# EAGLE design schemat (EAGLE 9.5.2)
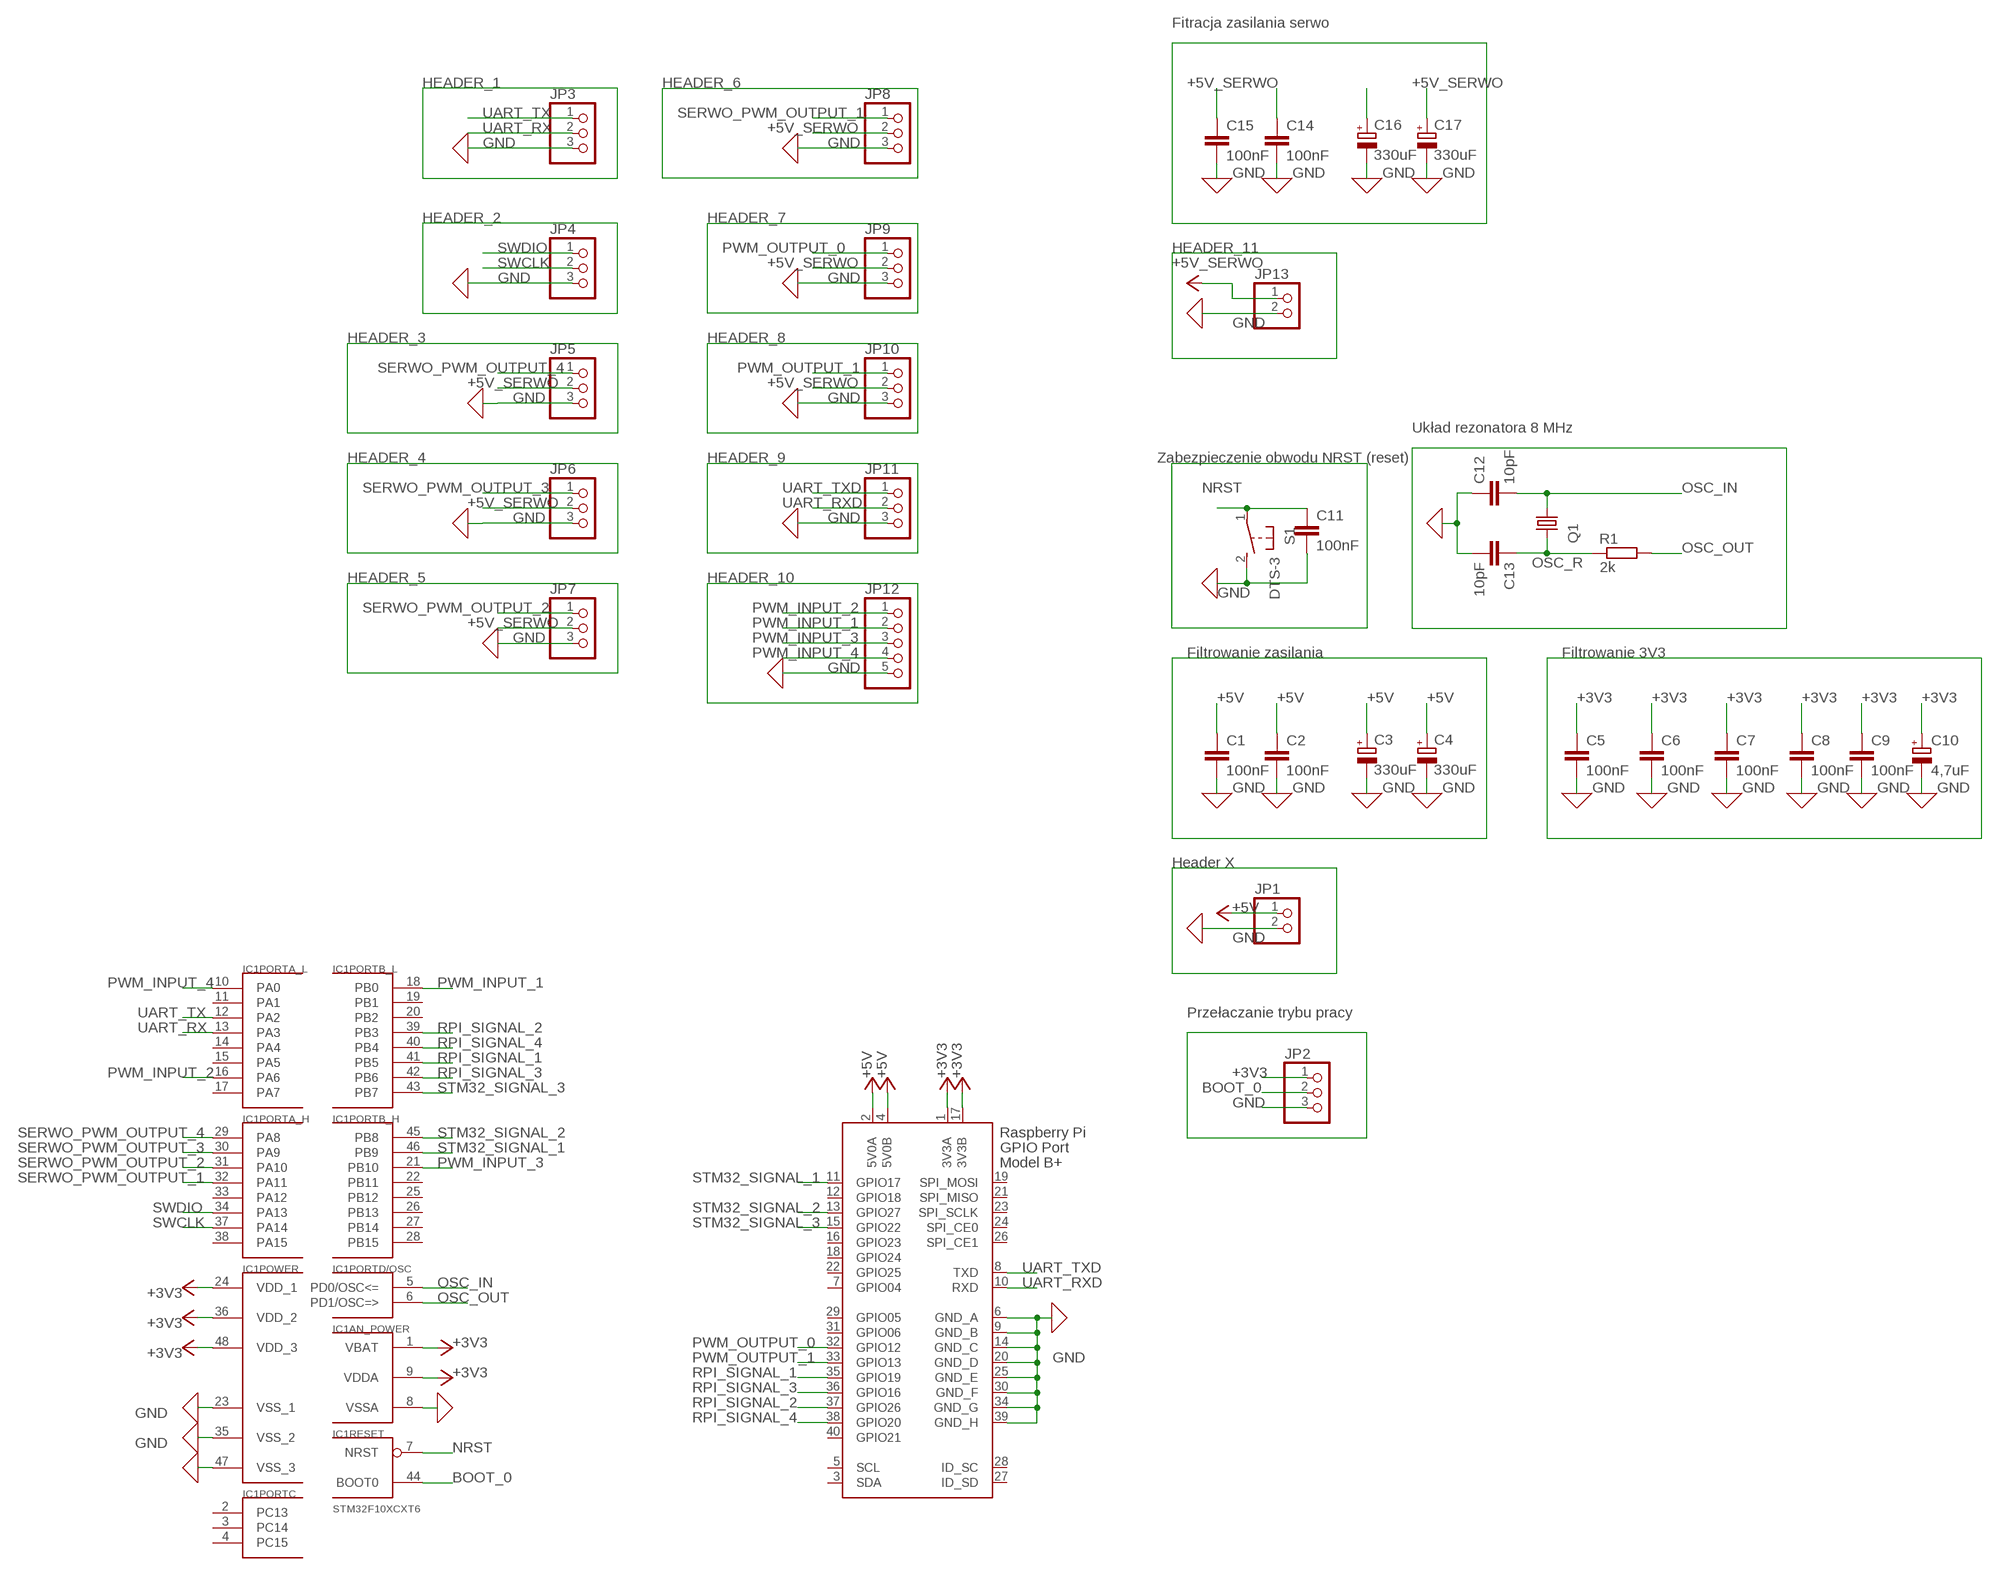
[diagram p0: schematic, sheet 1]

## Parts
C1  100nF  C-EUC0603  [C0603]
C2  100nF  C-EUC0603  [C0603]
C3  330uF  CPOL-EUE3.5-10  [E3,5-10]
C4  330uF  CPOL-EUE3.5-10  [E3,5-10]
C5  100nF  C-EUC0603  [C0603]
C6  100nF  C-EUC0603  [C0603]
C7  100nF  C-EUC0603  [C0603]
C8  100nF  C-EUC0603  [C0603]
C9  100nF  C-EUC0603  [C0603]
C10  4,7uF  CPOL-EUE2.5-4V  [E2,5RE]
C11  100nF  C-EUC0603  [C0603]
C12  10pF  C-EUC0603  [C0603]
C13  10pF  C-EUC0603  [C0603]
C14  100nF  C-EUC0603  [C0603]
C15  100nF  C-EUC0603  [C0603]
C16  330uF  CPOL-EUE3.5-10  [E3,5-10]
C17  330uF  CPOL-EUE3.5-10  [E3,5-10]
IC1  STM32F10XCXT6  [TQFP48]
JP1  PINHD-1X2  [1X02]
JP2  PINHD-1X3  [1X03]
JP3  PINHD-1X3  [1X03]
JP4  PINHD-1X3  [1X03]
JP5  PINHD-1X3  [1X03]
JP6  PINHD-1X3  [1X03]
JP7  PINHD-1X3  [1X03]
JP8  PINHD-1X3  [1X03]
JP9  PINHD-1X3  [1X03]
JP10  PINHD-1X3  [1X03]
JP11  PINHD-1X3  [1X03]
JP12  PINHD-1X5  [1X05]
JP13  PINHD-1X2  [1X02]
Q1  CRYSTALHC49UP  [HC49UP]
R1  2k  R-EU_R0603  [R0603]
S1  DTS-3  [DTS-3]
X1  RASPI_BOARD_B+#_E4P  [RASPI_BOARD_B+_EDGES_4DRILL_PAD]

## Nets
+3V3: C5.1 C6.1 C7.1 C8.1 C9.1 C10.+ IC1.1(AN_POWER:VBAT) IC1.9(AN_POWER:VDDA) IC1.24(POWER:VDD_1) IC1.36(POWER:VDD_2) IC1.48(POWER:VDD_3) JP2.1 X1.1(3V3A) X1.17(3V3B)
+5V: C1.1 C2.1 C3.+ C4.+ JP1.1 X1.2(5V0A) X1.4(5V0B)
+5V_SERWO: C14.1 C15.1 C16.+ C17.+ JP5.2 JP6.2 JP7.2 JP8.2 JP9.2 JP10.2 JP13.1 ; supply symbol labelled +5V
BOOT_0: IC1.44(RESET:BOOT0) JP2.2
GND: C1.2 C2.2 C3.- C4.- C5.2 C6.2 C7.2 C8.2 C9.2 C10.- C11.2 C12.1 C13.2 C14.2 C15.2 C16.- C17.- IC1.8(AN_POWER:VSSA) IC1.23(POWER:VSS_1) IC1.35(POWER:VSS_2) IC1.47(POWER:VSS_3) JP1.2 JP2.3 JP3.3 JP4.3 JP5.3 JP6.3 JP7.3 JP8.3 JP9.3 JP10.3 JP11.3 JP12.5 JP13.2 S1.2 X1.6(GND_A) X1.9(GND_B) X1.14(GND_C) X1.20(GND_D) X1.25(GND_E) X1.30(GND_F) X1.34(GND_G) X1.39(GND_H)
NRST: C11.1 IC1.7(RESET:NRST) S1.1
OSC_IN: C12.2 IC1.5(PORTD/OSC:PD0/OSC<=) Q1.1
OSC_OUT: IC1.6(PORTD/OSC:PD1/OSC=>) R1.2
OSC_R: C13.1 Q1.2 R1.1
PWM_INPUT_1: IC1.18(PORTB_L:PB0) JP12.2
PWM_INPUT_2: IC1.16(PORTA_L:PA6) JP12.1
PWM_INPUT_3: IC1.21(PORTB_H:PB10) JP12.3
PWM_INPUT_4: IC1.10(PORTA_L:PA0) JP12.4
PWM_OUTPUT_0: JP9.1 X1.32(GPIO12)
PWM_OUTPUT_1: JP10.1 X1.33(GPIO13)
RPI_SIGNAL_1: IC1.41(PORTB_L:PB5) X1.35(GPIO19)
RPI_SIGNAL_2: IC1.39(PORTB_L:PB3) X1.37(GPIO26)
RPI_SIGNAL_3: IC1.42(PORTB_L:PB6) X1.36(GPIO16)
RPI_SIGNAL_4: IC1.40(PORTB_L:PB4) X1.38(GPIO20)
SERWO_PWM_OUTPUT_1: IC1.32(PORTA_H:PA11) JP8.1
SERWO_PWM_OUTPUT_2: IC1.31(PORTA_H:PA10) JP7.1
SERWO_PWM_OUTPUT_3: IC1.30(PORTA_H:PA9) JP6.1
SERWO_PWM_OUTPUT_4: IC1.29(PORTA_H:PA8) JP5.1
STM32_SIGNAL_1: IC1.46(PORTB_H:PB9) X1.11(GPIO17)
STM32_SIGNAL_2: IC1.45(PORTB_H:PB8) X1.13(GPIO27)
STM32_SIGNAL_3: IC1.43(PORTB_L:PB7) X1.15(GPIO22)
SWCLK: IC1.37(PORTA_H:PA14) JP4.2
SWDIO: IC1.34(PORTA_H:PA13) JP4.1
UART_RX: IC1.13(PORTA_L:PA3) JP3.2
UART_RXD: JP11.2 X1.10(RXD)
UART_TX: IC1.12(PORTA_L:PA2) JP3.1
UART_TXD: JP11.1 X1.8(TXD)
Unconnected: IC1.2(PORTC:PC13) IC1.3(PORTC:PC14) IC1.4(PORTC:PC15) IC1.11(PORTA_L:PA1) IC1.14(PORTA_L:PA4) IC1.15(PORTA_L:PA5) IC1.17(PORTA_L:PA7) IC1.19(PORTB_L:PB1) IC1.20(PORTB_L:PB2) IC1.22(PORTB_H:PB11) IC1.25(PORTB_H:PB12) IC1.26(PORTB_H:PB13) IC1.27(PORTB_H:PB14) IC1.28(PORTB_H:PB15) IC1.33(PORTA_H:PA12) IC1.38(PORTA_H:PA15) X1.3(SDA) X1.5(SCL) X1.7(GPIO04) X1.12(GPIO18) X1.16(GPIO23) X1.18(GPIO24) X1.19(SPI_MOSI) X1.21(SPI_MISO) X1.22(GPIO25) X1.23(SPI_SCLK) X1.24(SPI_CE0) X1.26(SPI_CE1) X1.27(ID_SD) X1.28(ID_SC) X1.29(GPIO05) X1.31(GPIO06) X1.40(GPIO21)

## Notes on the sheet
- Fitracja zasilania serwo
- HEADER_1 | HEADER_6
- HEADER_2 | HEADER_7
- HEADER_11
- HEADER_3 | HEADER_8
- Układ rezonatora 8 MHz
- HEADER_4 | HEADER_9 | Zabezpieczenie obwodu NRST (reset)
- HEADER_5 | HEADER_10
- Filtrowanie zasilania | Filtrowanie 3V3
- Header X
- Przełaczanie trybu pracy

## Library data of the parts
C1 C2 C5-C9 C11-C15 = rcl:C-EU: CAPACITOR, European symbol; SPICEPREFIX: C
C3 C4 C10 C16 C17 = rcl:CPOL-EU: POLARIZED CAPACITOR, European symbol; SPICEPREFIX: C
IC1 = stm32:STM32F10XCXT6: ST STM32F101/103 48pin LQFP
JP1 JP13 = pinhead:PINHD-1X2: PIN HEADER
JP2-JP11 = pinhead:PINHD-1X3: PIN HEADER
JP12 = pinhead:PINHD-1X5: PIN HEADER
Q1 = crystal:CRYSTAL: CRYSTAL; OC_FARNELL: unknown; OC_NEWARK: unknown
R1 = rcl:R-EU_: RESISTOR, European symbol; SPICEPREFIX: R
S1 = switch-tact:DTS-3
X1 = raspberrypi_bastelstube_v13:RASPI_BOARD_B+#: Raspberry Pi GPIO connector with markings for the outer dimensions of the Raspberry Pi board model B+ with different sets of drill holes or mounting pads All pins connected

## Board
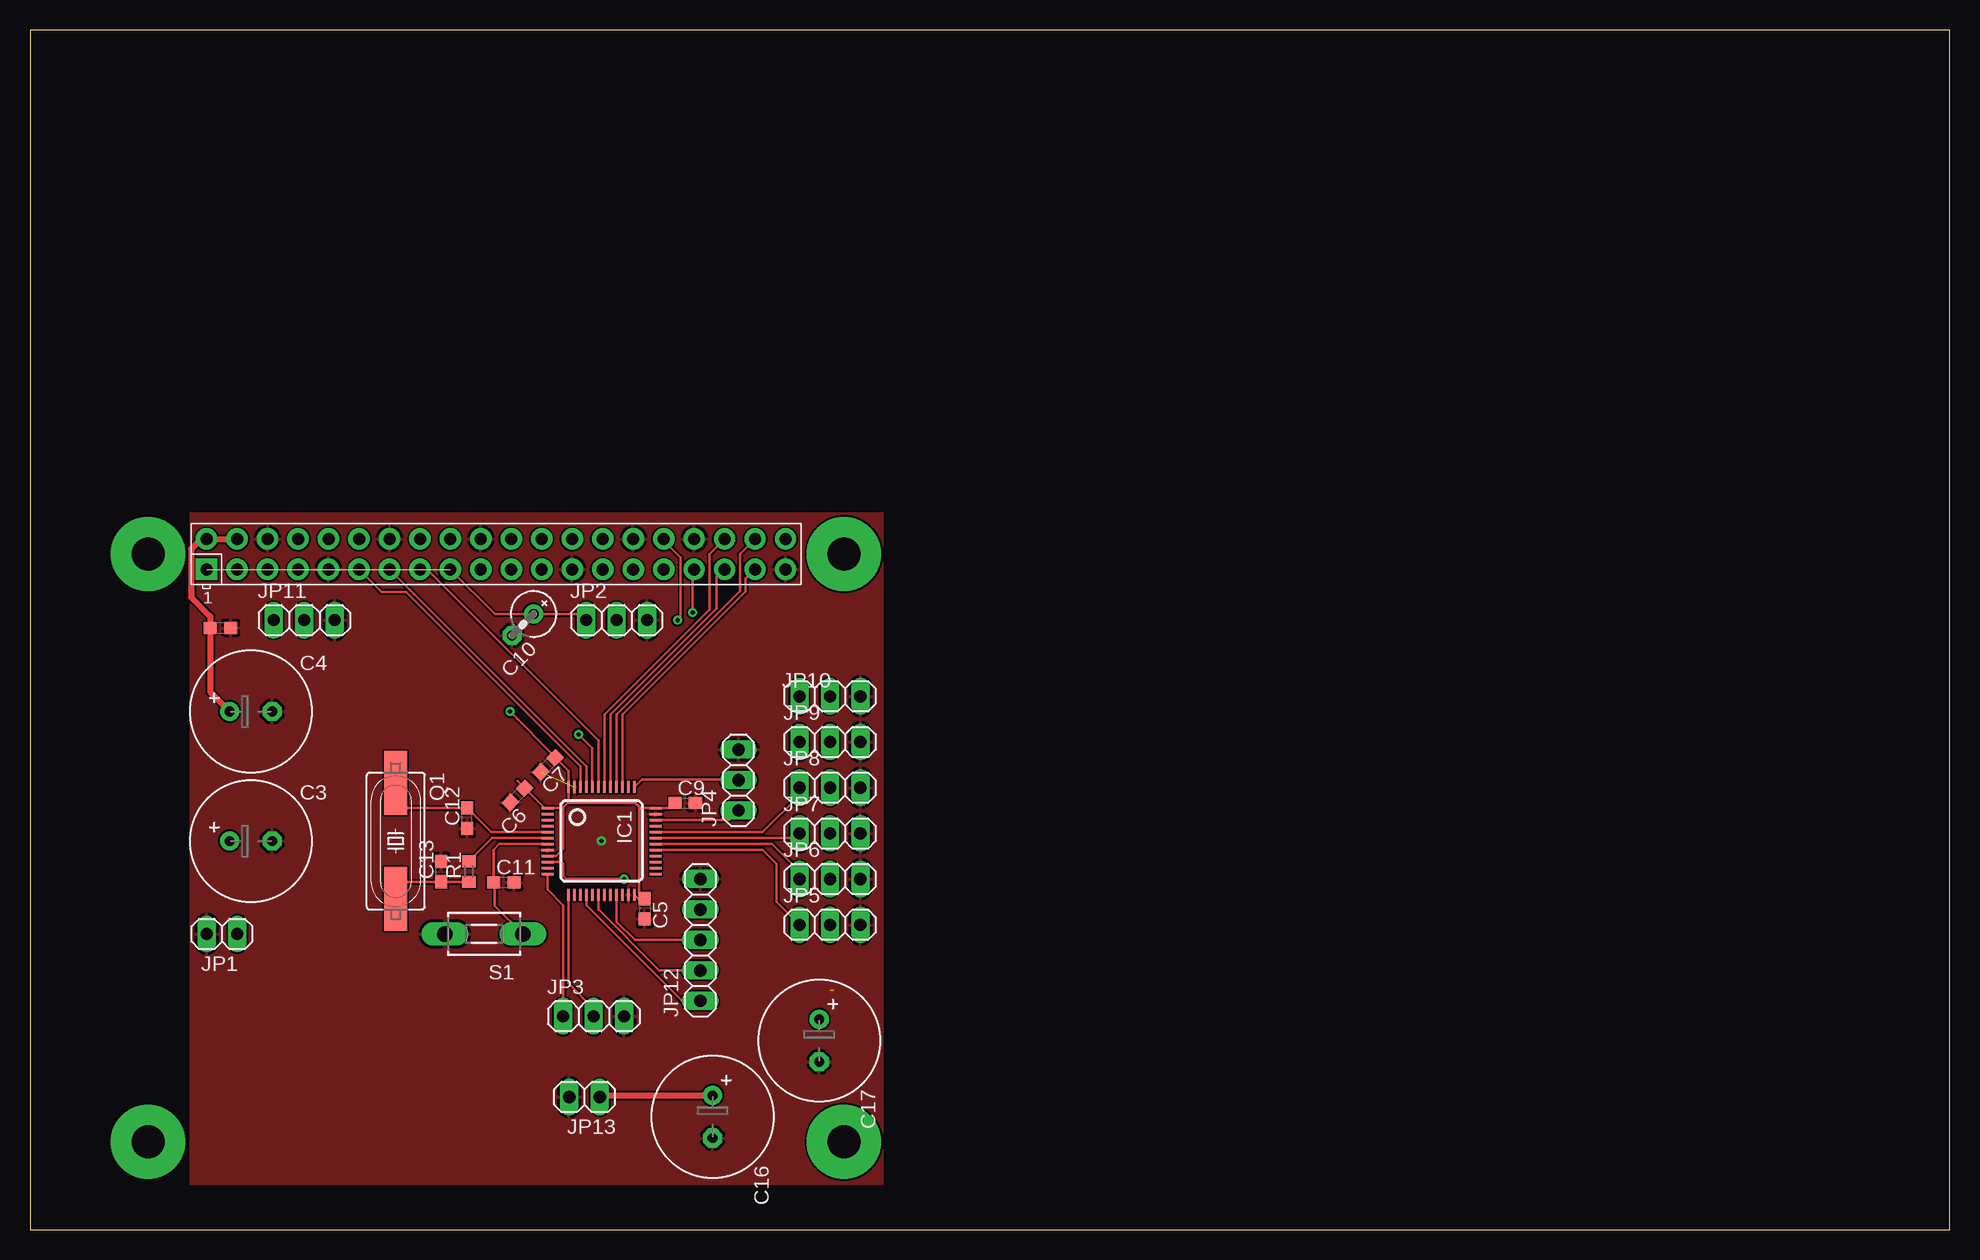
[diagram p1: board, top side]
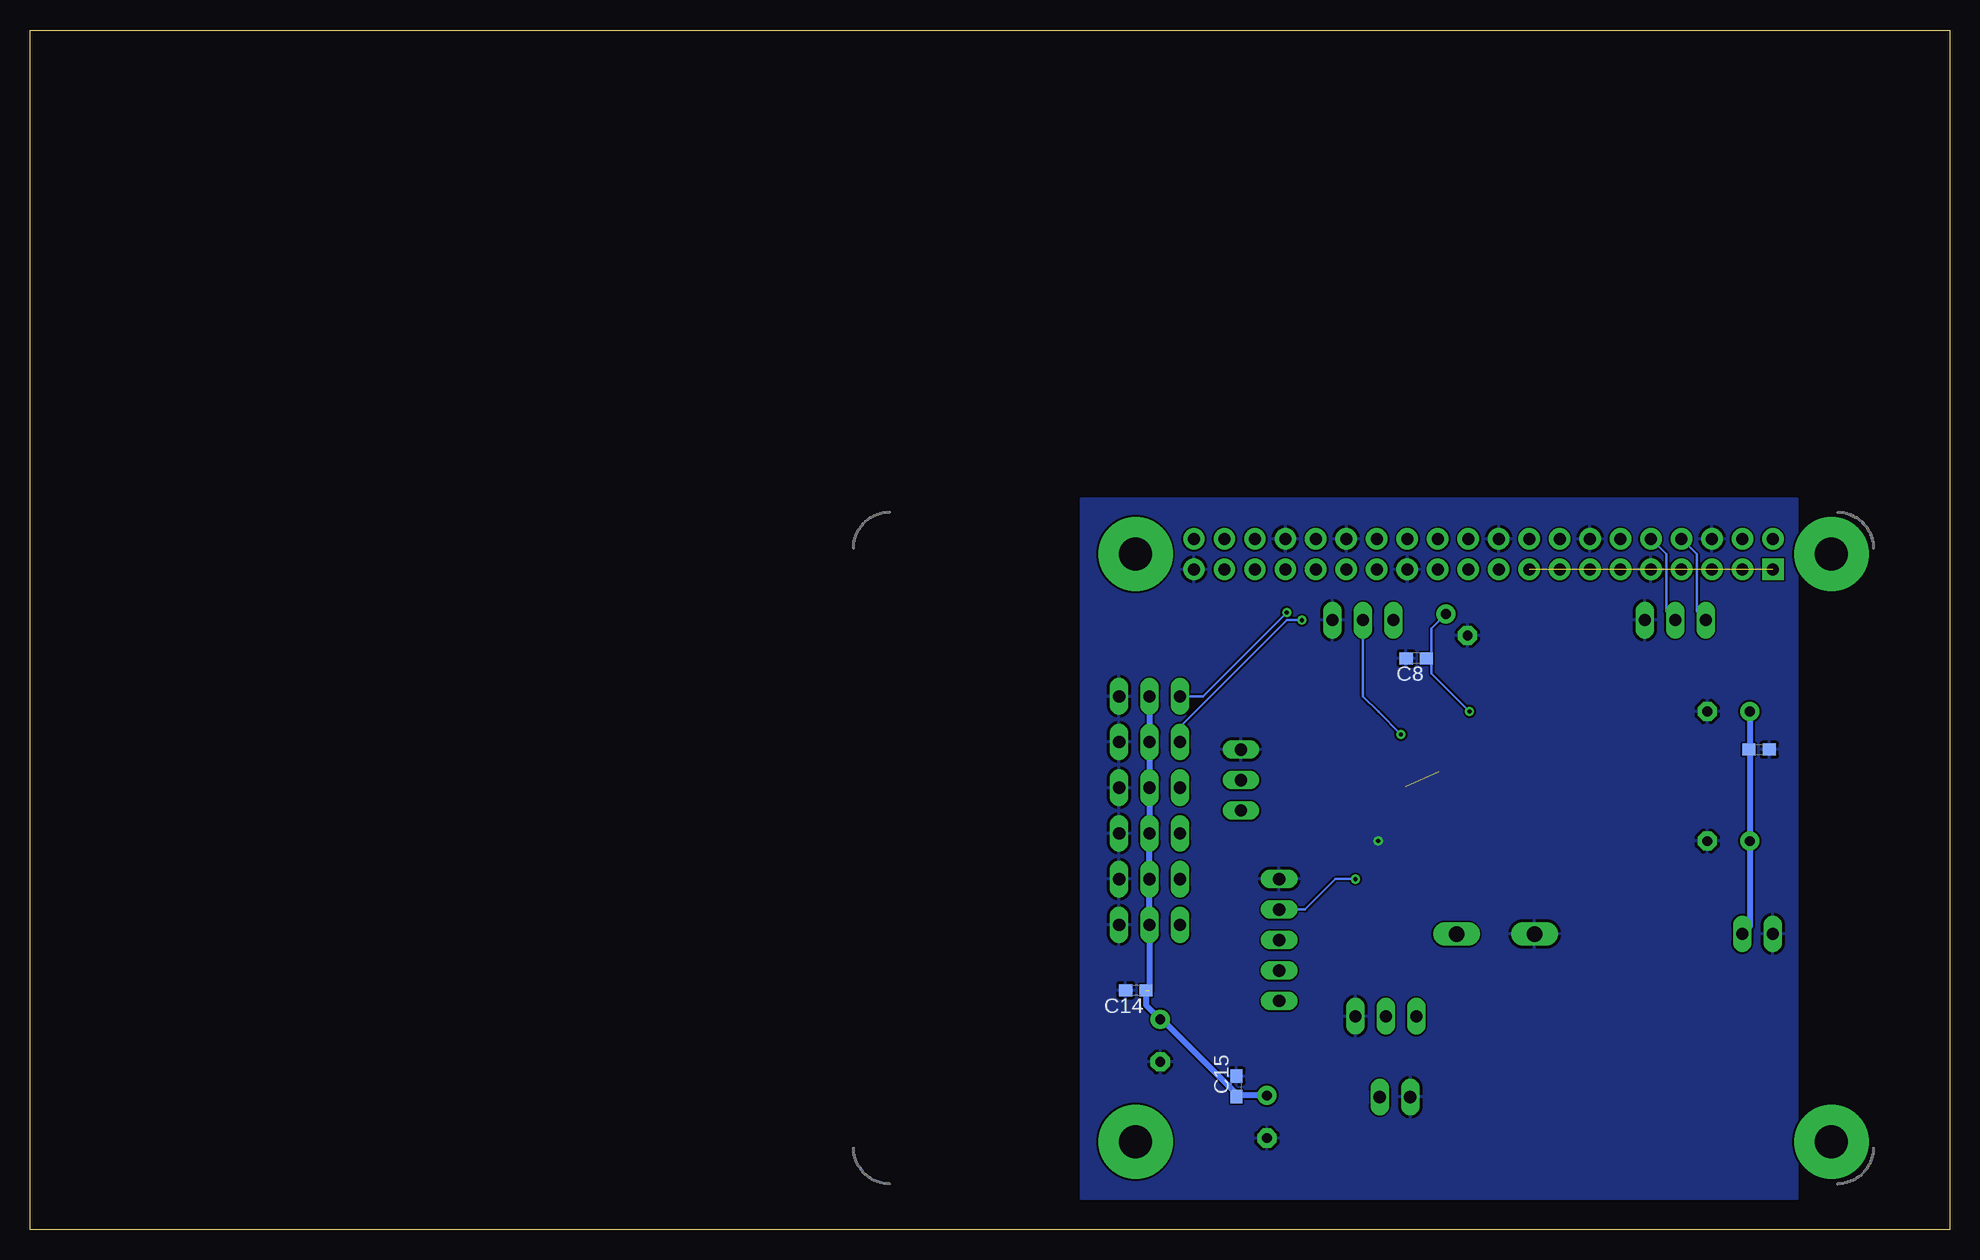
[diagram p2: board, bottom side, seen from below]

Size 160 x 100 mm. Coordinates in mm from the lower left corner, seen from the top.
Outline: 0,0 160,0 160,100 0,100 0,0
Copper layers (1*16): Top 0.035mm / dielectric 1.5mm / Bottom 0.035mm
Design rules "default": minimum track width 6mil, minimum drill 0.35mm, track to track 6mil, track to pad 6mil, pad to pad 6mil, via to via 6mil, smd to smd 6mil, copper to edge 40mil, drill to drill 6mil, minimum pad ring 10mil, minimum via ring 8mil, stop-mask expansion 4mil, vias tented up to drill 0mil, thermal gap 10mil

### Footprints (pad centres in the part's own frame; a part is rotated, then mirrored left to right if it is on the bottom)
C0603 = smd 1.1 x 1: 1 -0.85,0; 2 0.85,0
E3,5-10 = drill 0.813 pad 1.6: + -1.778,0 | drill 0.813 pad 1.6 octagon: - 1.778,0
E2,5RE = drill 0.813 pad 1.575: + -1.27,0 | drill 0.813 pad 1.575 octagon: - 1.27,0
TQFP48 = smd 0.2 x 1: 1 -2.75,-4.5; 2 -2.25,-4.5; 3 -1.75,-4.5; 4 -1.25,-4.5; 5 -0.75,-4.5; 6 -0.25,-4.5; 7 0.25,-4.5; 8 0.75,-4.5; 9 1.25,-4.5; 10 1.75,-4.5; 11 2.25,-4.5; 12 2.75,-4.5; 25 2.75,4.5; 26 2.25,4.5; 27 1.75,4.5; 28 1.25,4.5; 29 0.75,4.5; 30 0.25,4.5; 31 -0.25,4.5; 32 -0.75,4.5; 33 -1.25,4.5; 34 -1.75,4.5; 35 -2.25,4.5; 36 -2.75,4.5 | smd 1 x 0.2: 13 4.5,-2.75; 14 4.5,-2.25; 15 4.5,-1.75; 16 4.5,-1.25; 17 4.5,-0.75; 18 4.5,-0.25; 19 4.5,0.25; 20 4.5,0.75; 21 4.5,1.25; 22 4.5,1.75; 23 4.5,2.25; 24 4.5,2.75; 37 -4.5,2.75; 38 -4.5,2.25; 39 -4.5,1.75; 40 -4.5,1.25; 41 -4.5,0.75; 42 -4.5,0.25; 43 -4.5,-0.25; 44 -4.5,-0.75; 45 -4.5,-1.25; 46 -4.5,-1.75; 47 -4.5,-2.25; 48 -4.5,-2.75
1X02 = drill 1.016 long: 1 -1.27,0; 2 1.27,0
1X03 = drill 1.016 long: 1 -2.54,0; 2 0,0; 3 2.54,0
1X05 = drill 1.016 long: 1 -5.08,0; 2 -2.54,0; 3 0,0; 4 2.54,0; 5 5.08,0
HC49UP = smd 5.334 x 1.93: 1 -4.826,0; 2 4.826,0
R0603 = smd 1 x 1.1: 1 -0.85,0; 2 0.85,0
DTS-3 = drill 1.3 long: 1 -3.25,0; 2 3.25,0
RASPI_BOARD_B+_EDGES_4DRILL_PAD = drill 1 pad 1.778 square: 1 8.37,51.23 | drill 1 pad 1.778: 2 8.37,53.77; 3 10.91,51.23; 4 10.91,53.77; 5 13.45,51.23; 6 13.45,53.77; 7 15.99,51.23; 8 15.99,53.77; 9 18.53,51.23; 10 18.53,53.77; 11 21.07,51.23; 12 21.07,53.77; 13 23.61,51.23; 14 23.61,53.77; 15 26.15,51.23; 16 26.15,53.77; 17 28.69,51.23; 18 28.69,53.77; 19 31.23,51.23; 20 31.23,53.77; 21 33.77,51.23; 22 33.77,53.77; 23 36.31,51.23; 24 36.31,53.77; 25 38.85,51.23; 26 38.85,53.77; 27 41.39,51.23; 28 41.39,53.77; 29 43.93,51.23; 30 43.93,53.77; 31 46.47,51.23; 32 46.47,53.77; 33 49.01,51.23; 34 49.01,53.77; 35 51.55,51.23; 36 51.55,53.77; 37 54.09,51.23; 38 54.09,53.77; 39 56.63,51.23; 40 56.63,53.77 | drill 2.75 pad 6.2: 41 3.5,3.5; 42 61.5,3.5; 43 61.5,52.5; 44 3.5,52.5

### Placement (x,y rotation side)
C1  15.88,50.16 0 top
C2  15.88,40.01 0 bottom
C3  18.41,32.38 0 top
C4  18.41,43.18 0 top
C5  51.25,26.74 270 top
C6  40.64,36.2 225 top
C7  43.18,38.73 225 top
C8  44.45,47.62 180 bottom
C9  54.61,35.56 0 top
C10  41.07,50.42 225 top
C11  39.5,28.96 0 top
C12  36.45,34.29 90 top
C13  34.29,29.84 90 top
C14  67.82,19.94 180 bottom
C15  59.44,11.94 90 bottom
C16  56.9,9.4 270 top
C17  65.79,15.75 270 top
IC1  47.62,32.38 270 top
JP1  16,24.64 180 top
JP2  48.9,50.8 0 top
JP3  46.99,17.78 0 top
JP4  59.05,37.47 90 top
JP5  66.67,25.4 0 top
JP6  66.67,29.21 0 top
JP7  66.67,33.02 0 top
JP8  66.67,36.83 0 top
JP9  66.67,40.64 0 top
JP10  66.67,44.45 0 top
JP11  22.86,50.8 0 top
JP12  55.88,24.13 90 top
JP13  46.23,11.05 180 top
Q1  30.48,32.38 270 top
R1  36.58,29.84 90 top
S1  37.85,24.64 180 top
X1  6.35,3.81 0 top

### Tracks (layer width: path | path; a pad name or v marks a point on that pad's centre or on a via)
+3V3  (via drill 0.35)  (1 unrouted)
  Top 0.152: 43.78,39.4 C7.1 | 42.9,35.13 IC1.1
  Top 0.203: X1.17 38.76,51.32 C10.+ 45.84,51.32 JP2.1 | 50.76,34.92 50.76,35.26 50.46,35.56 44.83,35.56 | IC1.9 43.84,31.14 44.45,31.75 44.45,34.92 | 44.45,34.92 44.45,35.18 44.83,35.56 | 50.76,34.92 50.97,35.13 IC1.36 53.34,35.13 C9.1 | 44.83,35.56 44.9,35.62 44.9,36.87 | IC1.48 44.9,36.87 | IC1.1 44.24,35.13 44.45,34.92 | 43.78,39.4 v40.01,43.18 40.64,42.55 | C7.1 44.9,38.22 44.9,36.87 | 40.64,37.4 C6.1 42.9,35.13 | 50.76,34.92 50.76,28.08 C5.1 50.67,27.59 IC1.24
  Bottom 0.203: C10.+ 43.18,50.11 43.18,47.62 | v40.01,43.18 43.18,46.35 43.18,47.62 | C8.1 43.18,47.62
+5V
  Top 0.508: C4.+ 15.03,44.79 C1.1 15.03,51.11 13.43,52.71 13.43,56.73 14.27,57.58 X1.2 X1.4
  Bottom 0.508: C4.+ 16.64,40.09 C2.1 16.64,39.92 C3.+ 16.64,25.27 JP1.1
+5V_SERWO  (1 unrouted)
  Top 0.508: JP13.1 47.88,11.18 C16.+
  Bottom 0.508: C16.+ 59.35,11.18 C15.1 59.44,11.3 65.66,17.53 C17.+ | JP10.2 JP9.2 JP8.2 JP7.2 JP6.2 JP5.2 66.67,19.96 | C17.+ 66,17.53 | C14.1 66.97,18.71 C17.+
BOOT_0  (via drill 0.35)
  Top 0.203: v45.72,41.27 46.86,40.13 46.86,36.9 IC1.44
  Bottom 0.203: v45.72,41.27 47.62,43.18 48.9,44.45 JP2.2
GND  (via drill 0.35)  (1 unrouted)
  other vias: 47.62,32.38
  pour Top: 13.34,59.69 13.34,3.81 71.12,3.81 71.12,59.69
  pour Bottom: 12.7,60.96 12.7,2.54 72.39,2.54 72.39,60.96
NRST
  Top 0.203: IC1.7 39.12,32.13 38.65,31.66 C11.1 38.73,28.87 38.73,27 S1.1
OSC_IN
  Top 0.203: 36.28,35.31 C12.2 | Q1.1 30.48,35.94 31.28,35.14 C12.2 | C12.2 38.45,33.13 IC1.5
OSC_OUT
  Top 0.203: R1.2 38.52,32.64 IC1.6
OSC_R
  Top 0.203: 34.12,28.83 C13.1 | Q1.2 30.48,28.19 31.28,29 C13.1 | C13.1 R1.1
PWM_INPUT_1
  Top 0.203: IC1.18 47.38,26.67 | 47.38,26.67 | 47.38,26.67 52.45,21.59 JP12.2
PWM_INPUT_2
  Top 0.203: IC1.16 46.38,27.03 54.36,19.05 JP12.1
PWM_INPUT_3
  Top 0.203: IC1.21 48.9,27.86 48.9,25.65 50.42,24.13 JP12.3
PWM_INPUT_4  (via drill 0.35)
  Top 0.203: IC1.10 44.3,30.64 44.45,30.48 44.45,29.46 44.7,29.21 v49.53,29.21
  Bottom 0.203: JP12.4 53.72,26.67 51.18,29.21 v49.53,29.21
PWM_OUTPUT_0  (via drill 0.35)
  Top 0.203: X1.32 52.82,57.42 54.22,56.02 54.22,51.04 v53.98,50.8
  Bottom 0.203: v53.98,50.8 55.24,50.8 64.14,41.91 JP9.1
PWM_OUTPUT_1  (via drill 0.35)
  Top 0.203: X1.33 55.24,54.92 v55.24,51.44
  Bottom 0.203: v55.24,51.44 62.23,44.45 JP10.1
RPI_SIGNAL_1
  Top 0.203: X1.35 57.24,54.38 57.24,51.79 48.38,42.92 IC1.41
RPI_SIGNAL_2
  Top 0.203: X1.37 59.65,54.25 59.65,53.2 49.38,42.92 IC1.39
RPI_SIGNAL_3
  Top 0.203: IC1.42 47.88,42.93 56.63,51.68 56.63,56.31 X1.36
RPI_SIGNAL_4
  Top 0.203: IC1.40 48.88,42.92 59.17,53.22 59.17,56.31 X1.38
SERWO_PWM_OUTPUT_1
  Top 0.203: IC1.32 61.08,33.13 64.14,36.2 JP8.1
SERWO_PWM_OUTPUT_2
  Top 0.203: IC1.31 63.75,32.63 JP7.1
SERWO_PWM_OUTPUT_3
  Top 0.203: IC1.30 61.84,32.13 64.14,29.84 JP6.1
SERWO_PWM_OUTPUT_4
  Top 0.203: IC1.29 61.08,31.64 62.23,30.48 62.23,27.3 JP5.1
STM32_SIGNAL_1
  Top 0.203: IC1.46 45.88,38.61 31.35,53.13 29.32,53.13 X1.11
STM32_SIGNAL_2
  Top 0.203: X1.13 31.7,53.3 32.04,52.96 46.38,38.62 IC1.45
STM32_SIGNAL_3
  Top 0.203: IC1.43 47.38,40.76 33.1,55.04 X1.15
SWCLK
  Top 0.203: JP4.2 59,37.52 51.01,37.52 IC1.37
SWDIO
  Top 0.203: JP4.1 58.27,34.13 IC1.34
UART_RX
  Top 0.203: IC1.13 44.88,20.53 46.99,18.41 JP3.2
UART_RXD
  Bottom 0.203: JP11.2 23.61,51.55 23.61,56.31 X1.10
UART_TX
  Top 0.203: IC1.12 43.12,28.36 44.45,27.04 JP3.1
UART_TXD
  Bottom 0.203: JP11.1 21.07,51.55 21.07,56.31 X1.8